# Altium schematic sheet HPS_UART.SchDoc
size A4; Organization: ICNS, MARCS Institute; Address1: Werrington South Campus, Great Western Highway; Address2: Werrington, NSW, 2747; SheetNumber: 15; SheetTotal: 16
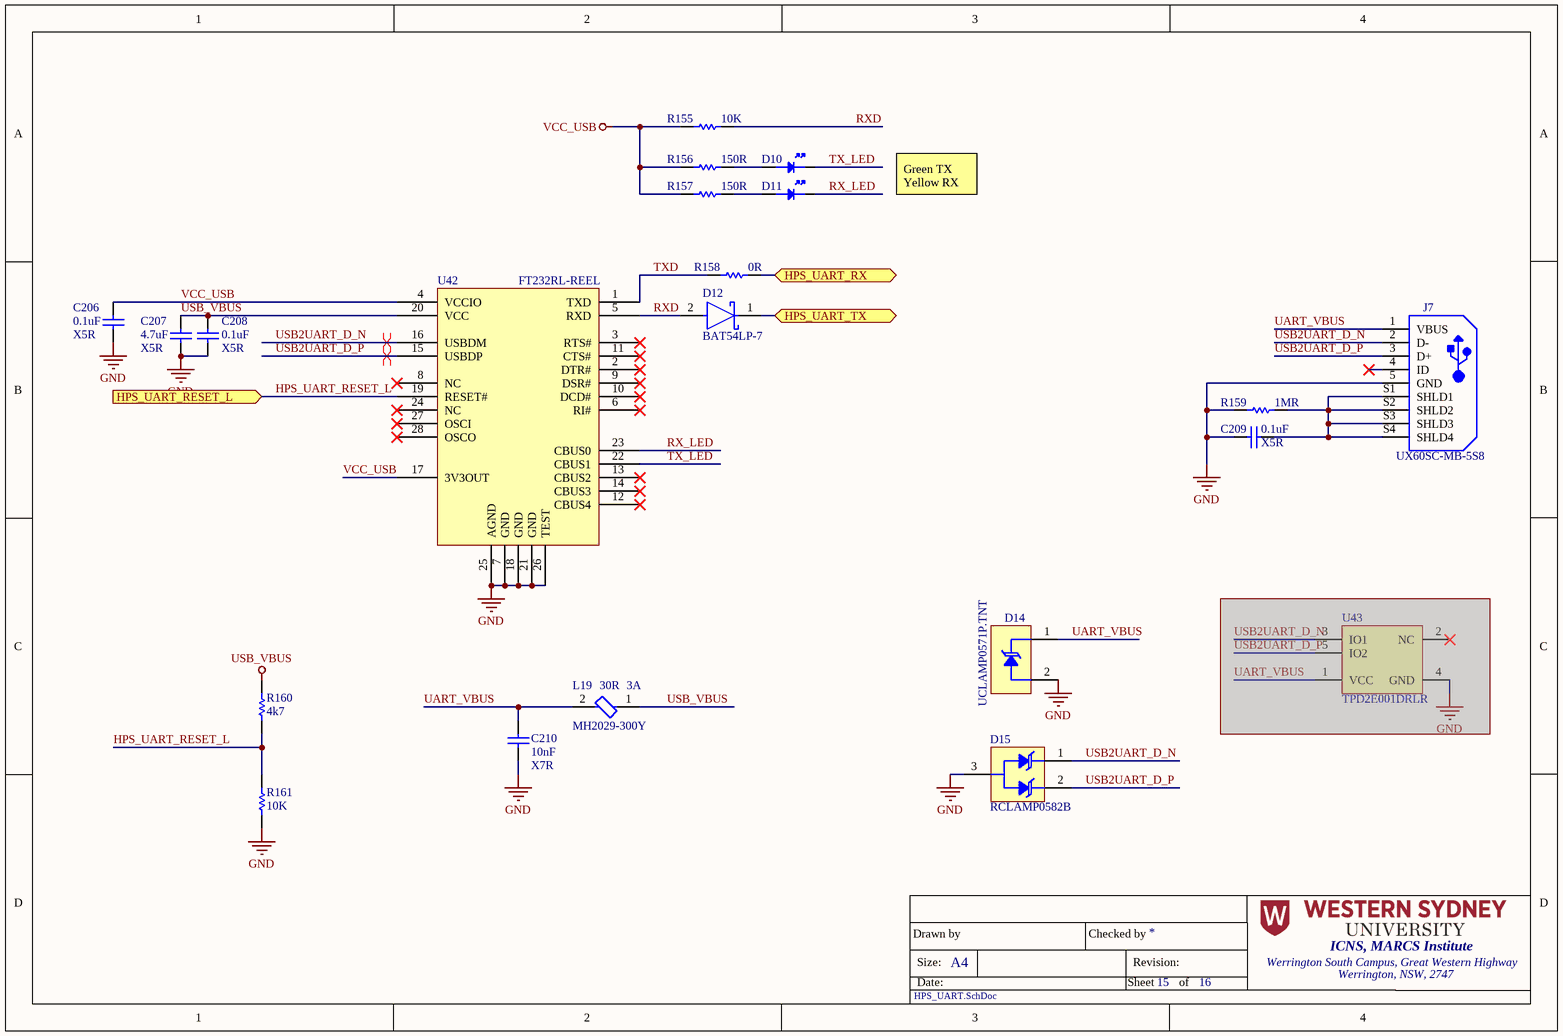
[diagram p0: HPS_UART.SchDoc]

## Parts
C206  value 0.1uF  Dielectric: X5R  [CAP 0201 (0603)]  (hidden comment: CL03A104KP3NNNC)
C207  value 4.7uF  Dielectric: X5R  [CAP 0402 (1005)]  (hidden comment: C1005X5R1A475K050BC)
C208  value 0.1uF  Dielectric: X5R  [CAP 0201 (0603)]  (hidden comment: CL03A104KP3NNNC)
C209  value 0.1uF  Dielectric: X5R  [CAP 0201 (0603)]  (hidden comment: CL03A104KP3NNNC)
C210  value 10nF  Dielectric: X7R  [CAP 0201 (0603)]  (hidden comment: GRM033R71A103KA01D)
D10  150060VS75000  [DIOC 0603 (1608)]  (value not drawn)
D11  150060YS75000  [DIOC 0603 (1608)]  (value not drawn)
D12  BAT54LP-7  [FP-X1-DFN1006-2-MFG]
D14  UCLAMP0571P.TNT  [uCLAMP0571P]
D15  RCLAMP0582B  [SOT50P160X90-3N]
J7  UX60SC-MB-5S8  [HIROSE_UX60SC-MB-5S8]
L19  MH2029-300Y  value 30R  Max DC Current: 3A  [INDC2016X13N]
R155  value 10K  [RES 0201 (0603)]  (hidden comment: AC0201FR-0710KL)
R156  value 150R  [RES 0603 (1608)]  (hidden comment: AC0603FR-10150RL)
R157  value 150R  [RES 0603 (1608)]  (hidden comment: AC0603FR-10150RL)
R158  value 0R  [RES 0201 (0603)]  (hidden comment: AF0201JR-070RL)
R159  value 1MR  [RES 0201 (0603)]  (hidden comment: ERJ-1GNF1004C)
R160  value 4k7  [RES 0201 (0603)]  (hidden comment: AC0201FR-074K7L)
R161  value 10K  [RES 0201 (0603)]  (hidden comment: AC0201FR-0710KL)
U42  FT232RL-REEL  [SOP65P780X200-28N]
U43  TPD2E001DRLR  [DRL0005A_L]  (masked out: inside a compile mask, not in the netlist)

## Ports
HPS_UART_RESET_L (in), HPS_UART_RX (bidir), HPS_UART_TX (bidir)

## Nets
GND: C206.2 C207.2 C208.2 C209.2 C210.2 D14.2(In_2) D15.3 J7.5(GND) R159.1 R161.1 U42.7(GND) U42.18(GND) U42.21(GND) U42.25(AGND) U42.26(TEST)
USB_VBUS: C207.1 C208.1 L19.1 R160.2 U42.20(VCC)
VCC_USB: C206.1 R155.2 R156.2 R157.2 U42.4(VCCIO) U42.17(3V3OUT)
HPS_UART_RESET_L: R160.1 R161.2 U42.19(RESET#) ; port HPS_UART_RESET_L
HPS_UART_RX: R158.1 ; port HPS_UART_RX
HPS_UART_TX: D12.1(C) ; port HPS_UART_TX
RX_LED: D11.1(K) U42.23(CBUS0)
RXD: D12.2(A) R155.1 U42.5(RXD)
TX_LED: D10.1(K) U42.22(CBUS1)
TXD: R158.2 U42.1(TXD)
UART_VBUS: C210.1 D14.1(In_1) J7.1(VBUS) L19.2
USB2UART_D_N: D15.1(In_1) J7.2(D-) U42.16(USBDM)
USB2UART_D_P: D15.2(In_2) J7.3(D+) U42.15(USBDP)
NetC209_1: C209.1 J7.S1(SHLD1) J7.S2(SHLD2) J7.S3(SHLD3) J7.S4(SHLD4) R159.2
NetD10_2: D10.2(A) R156.1
NetD11_2: D11.2(A) R157.1

Not connected (* = marked no-connect by the designer): J7 4(ID)*; U42 2(DTR#)* 3(RTS#)* 6(RI#)* 8(NC)* 9(DSR#)* 10(DCD#)* 11(CTS#)* 12(CBUS4)* 13(CBUS2)* 14(CBUS3)* 24(NC)* 27(OSCI)* 28(OSCO)*

## Layout directives
differential pair; net class DIGITAL; differential pair class USB2UART_D: USB2UART_D_N
differential pair; differential pair class USB2UART_D; net class DIGITAL: USB2UART_D_P

## Notes on the sheet
- Green TX
  Yellow RX
- Drawn by
- Size:
- Date:
- A4
- Checked by
- Sheet
- Revision:
- of

## Library data of the parts
C206 C208 C209 = CMP-003-000014-1: Cap Ceramic 0.1uF 10V X5R 10% Pad SMD 0201 85C T/R; Manufacturer: Samsung; Capacitance: 100nF; Stock 1: 12175; Pricing 1: 1=0.10000, 10=0.02900, 50=0.01600, 100=0.01300, 500=0.00932, 1000=0.00732, 2500=0.00666, 5000=0.00612 (USD); RoHS: Yes; Mount: Surface Mount; Case/Package: 0201; Case Code (Metric): 0603; Case Code (Imperial): 0201; Contact Plating: Tin; Min Operating Temperature: -55°C; Max Operating Temperature: 85°C; Tolerance: 10%; Packaging: Tape and Reel; Package Quantity: 1; Voltage Rating: 10V; Length: 0.6mm; Height: 0.3mm; Width: 0.012inch; Thickness: 0.013inch; Depth: 0.3mm; Radiation Hardening: No; ComponentLink1URL: https://datasheet.ciiva.com/25803/cl03a104kp3nnnc-25803204.pdf?src-supplier=Digi-Key; ComponentLink1Description: https://datasheet.ciiva.com/25803/cl03a104kp3nnnc-25803204.pdf?src-supplier=Digi-Key; ComponentLink2URL: https://datasheet.ciiva.com/26838/getdatasheetpartid-357484-26838083.pdf?src-supplier=Verical; ComponentLink2Description: https://datasheet.ciiva.com/26838/getdatasheetpartid-357484-26838083.pdf?src-supplier=Verical; Source: ICNS_PropheseeLib.SchLib; Manufacturer Part Number: CL03A104KP3NNNC; Lead Free: Lead Free; Series: CL; Design Item ID: CL03A104KP3NNNC; Voltage Rating (DC): 10V; Category: Ceramic Capacitors; Construction: Flat
C207 = CMP-003-000024-1: Cap Multilayer Ceramic 4.7uF 10 V X5R ±10 % SMT 0402  C Series; Manufacturer: TDK; Tolerance: 10%; Voltage Rating: 10V; Stock 1: 490145; Pricing 1: 1=0.48000, 10=0.33000, 50=0.23100, 100=0.19800, 500=0.14850, 1000=0.12540, 2500=0.11880, 5000=0.11220 (USD); RoHS: Yes; Mount: Surface Mount; Case/Package: 0402; Case Code (Metric): 1005; Case Code (Imperial): 0402; Min Operating Temperature: -55°C; Max Operating Temperature: 85°C; Packaging: Cut Tape; Package Quantity: 10000; Capacitance: 4.7uF; Length: 0.039inch; Width: 0.02inch; Thickness: 0.022inch; ComponentLink1URL: https://datasheet.ciiva.com/14895/tdkmlcccaprange-14895670.pdf?src-supplier=Digi-Key; ComponentLink1Description: https://datasheet.ciiva.com/14895/tdkmlcccaprange-14895670.pdf?src-supplier=Digi-Key; ComponentLink2URL: https://datasheet.ciiva.com/14895/tdkmlcccaprange-14895671.pdf?src-supplier=Digi-Key; ComponentLink2Description: https://datasheet.ciiva.com/14895/tdkmlcccaprange-14895671.pdf?src-supplier=Digi-Key; ComponentLink3Description: https://datasheet.ciiva.com/14895/tdkmlcccaprange-14895672.pdf?src-supplier=Digi-Key; REACH SVHC: No SVHC; Lead Free: Lead Free; Category: Ceramic Capacitors; Series: C; ComponentLink3URL: https://datasheet.ciiva.com/14895/tdkmlcccaprange-14895672.pdf?src-supplier=Digi-Key; Voltage Rating (DC): 10V; Source: ICNS_PropheseeLib.SchLib; Design Item ID: C1005X5R1A475K050BC; Dielectric Material: Ceramic; Manufacturer Part Number: C1005X5R1A475K050BC
C210 = CMP-003-000022-2: Cap Multilayer Ceramic 10nF 10V X7R 0201 ±10 % Tolerance SMT; Manufacturer: Murata; Tolerance: 10%; Stock 1: 6245; Pricing 1: 1=0.10000, 10=0.02000, 50=0.01060, 100=0.00870, 500=0.00624, 1000=0.00490, 2500=0.00446, 5000=0.00410 (USD); RoHS: Yes; Mount: Surface Mount; Case/Package: 0201; Case Code (Metric): 0603; Case Code (Imperial): 0201; Min Operating Temperature: -55°C; Max Operating Temperature: 125°C; Packaging: Tape and Reel; Package Quantity: 1; Capacitance: 10nF; Voltage Rating: 10V; Length: 0.6mm; Height: 0.3mm; Width: 0.012inch; Thickness: 0.013inch; Depth: 0.3mm; Radiation Hardening: No; ComponentLink1URL: https://datasheet.ciiva.com/129/grm033r71a103ka01-01-129814.pdf?src-supplier=Digi-Key; ComponentLink1Description: https://datasheet.ciiva.com/129/grm033r71a103ka01-01-129814.pdf?src-supplier=Digi-Key; ComponentLink2URL: https://datasheet.ciiva.com/129/grm033r71a103ka01-01-129815.pdf?src-supplier=Digi-Key; ComponentLink2Description: https://datasheet.ciiva.com/129/grm033r71a103ka01-01-129815.pdf?src-supplier=Digi-Key; Source: ICNS_PropheseeLib.SchLib; Manufacturer Part Number: GRM033R71A103KA01D; Lead Free: Lead Free; Design Item ID: GRM033R71A103KA01D; Voltage Rating (DC): 10V; Category: Ceramic Capacitors; Material: Ceramic; ComponentLink7URL: https://datasheet.ciiva.com/5422/product-5422667.pdf?src-supplier=Mouser; ComponentLink5URL: https://datasheet.ciiva.com/18184/getdatasheetpartid-158821-18184066.pdf?src-supplier=Verical; ComponentLink4URL: https://datasheet.ciiva.com/16467/product-16467346.pdf?src-supplier=Future+Electronics; ComponentLink3URL: https://datasheet.ciiva.com/11789/0900766b80ef921d-11789049.pdf?src-supplier=RSComponents; Voltage: 10V; RoHS Compliant: Yes; ComponentLink3Description: https://datasheet.ciiva.com/11789/0900766b80ef921d-11789049.pdf?src-supplier=RSComponents; ComponentLink5Description: https://datasheet.ciiva.com/18184/getdatasheetpartid-158821-18184066.pdf?src-supplier=Verical; ComponentLink6URL: https://datasheet.ciiva.com/29199/455719-da-01-en-vs-kondensator-0201-29199284.pdf?src-supplier=Conrad; ComponentLink6Description: https://datasheet.ciiva.com/29199/455719-da-01-en-vs-kondensator-0201-29199284.pdf?src-supplier=Conrad; ComponentLink7Description: https://datasheet.ciiva.com/5422/product-5422667.pdf?src-supplier=Mouser; ComponentLink4Description: https://datasheet.ciiva.com/16467/product-16467346.pdf?src-supplier=Future+Electronics; Termination: SMD/SMT; REACH SVHC: No SVHC
D10 = CMP-004-000007-2: Led, Green, 570 Nm, 2 V, 30 Ma, 40 Mcd Rohs Compliant: Yes; Manufacturer: Wurth Electronics; Wavelength: 570nm; Forward Voltage: 2V; Forward Current: 30mA; Lens Style: Clear,Rectangular; Luminous Intensity: 40mcd; Test Current: 20mA; Viewing Angle: 140°; Case/Package: 0603; Case Code (Metric): 1608; Width: 0.8mm; Height: 0.7mm; Case Code (Imperial): 0603; Min Operating Temperature: -40°C; Mount: Surface Mount; REACH SVHC: Unknown; Packaging: Tape and Reel; Color: Green; Max Operating Temperature: 85°C; Package Quantity: 1; Dominant Wavelength: 570nm; Length: 1.6mm; RoHS Compliant: Yes; Source: ICNS_PropheseeLib.SchLib; Design Item ID: 150060VS75000; ComponentLink1Description: https://datasheet.ciiva.com/29562/150060vs75000-29562919.pdf?src-supplier=Digi-Key; Manufacturer Part Number: 150060VS75000; Pricing 1: 100=0.13300, 500=0.10300, 1000=0.09800, 2000=0.09200, 4000=0.08800 (USD); Category: LEDs; RoHS: Yes; Number of Pins: 2; Stock 1: 1; ComponentLink1URL: https://datasheet.ciiva.com/29562/150060vs75000-29562919.pdf?src-supplier=Digi-Key
D11 = CMP-004-000008-2: Led, Yellow, 590 Nm, 2 V, 30 Ma, 120 Mcd Rohs Compliant: Yes; Manufacturer: Wurth Electronics; Wavelength: 590nm; Forward Voltage: 2V; Forward Current: 30mA; Lens Style: Clear,Rectangular; Luminous Intensity: 120mcd; Test Current: 20mA; Viewing Angle: 140°; Case/Package: 0603; Case Code (Metric): 1608; Width: 0.8mm; Height: 0.7mm; Case Code (Imperial): 0603; Min Operating Temperature: -40°C; Mount: Surface Mount; REACH SVHC: Unknown; Packaging: Tape and Reel; Color: Yellow; Max Operating Temperature: 85°C; Package Quantity: 4000; Dominant Wavelength: 590nm; Length: 1.6mm; RoHS Compliant: Yes; ComponentLink5Description: https://datasheet.ciiva.com/29563/150060ys75000-29563045.pdf?src-supplier=Digi-Key; ComponentLink2URL: https://datasheet.ciiva.com/29279/759432-da-01-en-chipled-0603-w-kl-gelb-150060ys75000-29279206.pdf?src-supplier=Conrad; ComponentLink1Description: https://datasheet.ciiva.com/23843/150060ys75000-23843250.pdf?src-supplier=Newark; Design Item ID: 150060YS75000; ComponentLink4Description: https://datasheet.ciiva.com/29563/150060ys75000-29563033.pdf?src-supplier=Digi-Key; ComponentLink6URL: https://datasheet.ciiva.com/22656/1911348-22656951.pdf?src-supplier=Element14; ComponentLink6Description: https://datasheet.ciiva.com/22656/1911348-22656951.pdf?src-supplier=Element14; ComponentLink4URL: https://datasheet.ciiva.com/29563/150060ys75000-29563033.pdf?src-supplier=Digi-Key; ComponentLink3Description: https://datasheet.ciiva.com/48430/150060ys75000-eng-tds-48430044.pdf?src-supplier=Distrelec; ComponentLink5URL: https://datasheet.ciiva.com/29563/150060ys75000-29563045.pdf?src-supplier=Digi-Key; RoHS: Yes; Manufacturer Part Number: 150060YS75000; Source: ICNS_PropheseeLib.SchLib; Category: LEDs; ComponentLink3URL: https://datasheet.ciiva.com/48430/150060ys75000-eng-tds-48430044.pdf?src-supplier=Distrelec; Stock 1: 1; ComponentLink1URL: https://datasheet.ciiva.com/23843/150060ys75000-23843250.pdf?src-supplier=Newark; Pricing 1: 100=0.13300, 500=0.10300, 1000=0.09800, 2000=0.09200, 4000=0.08800 (USD); ComponentLink2Description: https://datasheet.ciiva.com/29279/759432-da-01-en-chipled-0603-w-kl-gelb-150060ys75000-29279206.pdf?src-supplier=Conrad
D12 = CMP-004-000001-1: Diode Schottky 30 V 200mA (DC); Manufacturer: Diodes; Capacitance: 10pF; Forward Voltage: 1V; Max Reverse Voltage (DC): 30V; Max Forward Surge Current (Ifsm): 600mA; Reverse Recovery Time: 5ns; Power Dissipation: 250mW; Element Configuration: Single; Polarity: Standard; Max Reverse Current: 2uA; Manufacturer Part Number: BAT54LP-7; ComponentLink2URL: https://datasheet.ciiva.com/16210/ds30504-16210561.pdf?src-supplier=Future+Electronics; Forward Current: 200mA; ComponentLink2Description: https://datasheet.ciiva.com/16210/ds30504-16210561.pdf?src-supplier=Future+Electronics; Category: Schottky Diodes; Lead Free: Lead Free; RoHS: Yes; Height: 0.47mm; REACH SVHC: No SVHC; ComponentLink1Description: https://datasheet.ciiva.com/4715/ds30504-85267-4715512.pdf?src-supplier=Mouser; Max Operating Temperature: 125°C; Source: ICNS_PropheseeLib.SchLib; ComponentLink11URL: https://datasheet.ciiva.com/913/ds30504-913080.pdf?src-supplier=Digi-Key; Package Quantity: 3000; Min Operating Temperature: -65°C; ComponentLink8Description: https://datasheet.ciiva.com/8300/ds30504-8300695.pdf?src-supplier=Avnet; Voltage Rating (DC): 30V; Number of Pins: 2; Series: -; Output Current: 200mA; Pricing 1: 50=0.37100, 500=0.34200, 1250=0.32200, 2500=0.29500, 5000=0.27200 (USD); Design Item ID: BAT54LP-7; Peak Non-Repetitive Surge Current: 600mA; ComponentLink9URL: https://datasheet.ciiva.com/913/ds30504-913081.pdf?src-supplier=Digi-Key; Width: 0.6mm; ComponentLink7Description: https://datasheet.ciiva.com/25947/ds30504-25947226.pdf?src-supplier=Avnet+Europe; ComponentLink3Description: https://datasheet.ciiva.com/1180/ds30504-1180298.pdf?src-supplier=Element14; Packaging: Tape and Reel; ComponentLink10URL: https://datasheet.ciiva.com/913/ds30504-913082.pdf?src-supplier=Digi-Key; ComponentLink6Description: https://datasheet.ciiva.com/15144/getdatasheetpartid-39647-15144085.pdf?src-supplier=Verical; ComponentLink4URL: https://datasheet.ciiva.com/22695/1915672-22695255.pdf?src-supplier=Element14; ComponentLink6URL: https://datasheet.ciiva.com/15144/getdatasheetpartid-39647-15144085.pdf?src-supplier=Verical; ComponentLink1URL: https://datasheet.ciiva.com/4715/ds30504-85267-4715512.pdf?src-supplier=Mouser; Max Repetitive Reverse Voltage (Vrrm): 30V; ComponentLink5URL: https://datasheet.ciiva.com/8303/ds30504-8303286.pdf?src-supplier=Avnet; Stock 1: 3850; Contact Plating: Gold; Radiation Hardening: No; Mount: Surface Mount; RoHS Compliant: Yes; ComponentLink5Description: https://datasheet.ciiva.com/8303/ds30504-8303286.pdf?src-supplier=Avnet; Length: 1mm; Average Rectified Current: 200mA; ComponentLink8URL: https://datasheet.ciiva.com/8300/ds30504-8300695.pdf?src-supplier=Avnet; ComponentLink7URL: https://datasheet.ciiva.com/25947/ds30504-25947226.pdf?src-supplier=Avnet+Europe; Power Rating: 250mW; ComponentLink4Description: https://datasheet.ciiva.com/22695/1915672-22695255.pdf?src-supplier=Element14; ComponentLink9Description: https://datasheet.ciiva.com/913/ds30504-913081.pdf?src-supplier=Digi-Key; ComponentLink3URL: https://datasheet.ciiva.com/1180/ds30504-1180298.pdf?src-supplier=Element14; Current Rating: 200mA; ComponentLink10Description: https://datasheet.ciiva.com/913/ds30504-913082.pdf?src-supplier=Digi-Key; Case/Package: DFN; ComponentLink11Description: https://datasheet.ciiva.com/913/ds30504-913080.pdf?src-supplier=Digi-Key
D14 = CMP-024-000002-2: ESD Suppressor Diode TVS Uni-Dir 5V Automotive 2-Pin SGP T/R; Manufacturer: Semtech; Clamping Voltage: 15V; Peak Pulse Current: 80A; Number of Unidirectional Channels: 1; Power Line Protection: No; Min Breakdown Voltage: 6V; Number of Pins: 2; Design Item ID: UCLAMP0571P.TNT; Packaging: Tape and Reel; ComponentLink2URL: https://media.digikey.com/pdf/Data%20Sheets/~No%20Display/Semtech%20PDFs/uClamp0571P-3671P.pdf?src-supplier=Digi-Key; Max Operating Temperature: 125°C; Stock 1: 16165; RoHS: Yes; Source: Falcon_Neuro.SchLib; Reverse Standoff Voltage: 5V; ComponentLink1Description: http://www.mouser.com/ds/2/761/uclampxx71p_2-779780.pdf?src-supplier=Mouser; Min Operating Temperature: -40°C; ComponentLink1URL: http://www.mouser.com/ds/2/761/uclampxx71p_2-779780.pdf?src-supplier=Mouser; ComponentLink2Description: https://media.digikey.com/pdf/Data%20Sheets/~No%20Display/Semtech%20PDFs/uClamp0571P-3671P.pdf?src-supplier=Digi-Key; Resistor Type: Zener; Mount: Surface Mount; Pricing 1: 1=0.91000, 10=0.79900, 50=0.79900, 100=0.61300, 500=0.48400, 1000=0.38800, 2500=0.35100, 5000=0.31900, 10000=0.30700 (USD); Category: TVS Diodes; Manufacturer Part Number: UCLAMP0571P.TNT
D15 = CMP-004-000012-1: ESD Suppressor TVS Uni-Dir/Bi-Dir 5V 3-Pin SOT-523 T/R; Manufacturer Part Number: RCLAMP0582B.TCT; Manufacturer: Semtech; Peak Pulse Current: 15A; Min Breakdown Voltage: 6V; Leakage Current: 100nA; Peak Pulse Power: 300W; Direction: Unidirectional,Bidirectional; Clamping Voltage: 20V; Number of Unidirectional Channels: 2; Diode Type: ZENER; Power Line Protection: No; ComponentLink1URL: http://www.mouser.com/ds/2/761/down-768397.pdf?src-supplier=Mouser; Source: ICNS_PropheseeLib.SchLib; ComponentLink2Description: http://components.arrow.com/part/dataview/51525300S194820N8297?src-supplier=Arrow+Electronics; Case/Package: SC; ComponentLink3URL: http://www.semtech.com/images/datasheet/rclamp0582b.pdf?src-supplier=Digi-Key; Depth: 0.8mm; Pricing 1: 3000=0.34050, 9000=0.32450, 24000=0.31460 (USD); Resistor Type: Zener; Packaging: Tape and Reel; Category: TVS Diodes; Mount: Surface Mount; Design Item ID: RCLAMP0582B; Radiation Hardening: No; Working Voltage: 5V; RoHS: Yes; Reverse Standoff Voltage: 5V; ComponentLink3Description: http://www.semtech.com/images/datasheet/rclamp0582b.pdf?src-supplier=Digi-Key; Min Operating Temperature: -55°C; Number of Pins: 3; Max Operating Temperature: 125°C; ComponentLink2URL: http://components.arrow.com/part/dataview/51525300S194820N8297?src-supplier=Arrow+Electronics; ComponentLink1Description: http://www.mouser.com/ds/2/761/down-768397.pdf?src-supplier=Mouser; Series: RailClamp®; Stock 1: 48000; Length: 1.6mm
J7 = CMP-010-000018-4: Conn Mini USB 2.0 Type B RCP 5 POS 0.8mm Solder RA SMD/Thru-Hole 5 Terminal 1 Port T/R; Manufacturer: Hirose; Number of Contacts: 5; Number of Ports: 1; Gender: Receptacle; Connector Type: USB,Receptacle; Current Rating: 1A; Insulation Resistance: 100MR; Max Voltage Rating (AC): 5V; USB Standard: USB 2.0; Packaging: Tape and Reel; Pitch: 0.8mm; Contact Plating: Gold; Contact Material: Copper Alloy,Copper; RoHS: Yes; Length: 7.7mm; ComponentLink2Description: https://datasheet.ciiva.com/4598/ed-ux-20140717-4598805.pdf?src-supplier=Mouser; ComponentLink2URL: https://datasheet.ciiva.com/4598/ed-ux-20140717-4598805.pdf?src-supplier=Mouser; Design Item ID: UX60SC-MB-5S8; ComponentLink3URL: https://datasheet.ciiva.com/15181/getdatasheetpartid-457316-15181367.pdf?src-supplier=Verical; Number of Positions: 5; Number of Terminals/Pins: 5; Package Quantity: 1000; Min Operating Temperature: -30°C; Series: UX60S; Mount: Surface Mount,Horizontal,Through Hole; Max Operating Temperature: 75°C; Manufacturer Part Number: UX60SC-MB-5S8; Termination: Solder; ComponentLink1Description: https://datasheet.ciiva.com/22666/1693469-22666928.pdf?src-supplier=Element14; Orientation: Right Angle; Lead Free: Lead Free; Depth: 7mm; Max Current Rating: 1A; Number of Rows: 1; REACH SVHC: No SVHC; RoHS Compliant: Yes; Pricing 1: 1000=0.49400, 2000=0.44800, 5000=0.43300 (USD); Category: USB Connectors; Source: ICNS_PropheseeLib.SchLib; ComponentLink3Description: https://datasheet.ciiva.com/15181/getdatasheetpartid-457316-15181367.pdf?src-supplier=Verical; ComponentLink1URL: https://datasheet.ciiva.com/22666/1693469-22666928.pdf?src-supplier=Element14; Stock 1: 1340
L19 = CMP-005-000010-1: FERRITE BEAD 30 OHM 0805 1LN; Manufacturer: Bourns; Current Rating: 4A; DC Resistance (DCR): 30mR; Shielding: Unshielded; Tolerance: 25%; Number of Lines: 1; Test Frequency: 100MHz; Case/Package: 0805; Core Material: Ferrite; Pricing 1: 1=0.08450, 10=0.07180, 25=0.06060, 100=0.03370 (USD); RoHS: Yes; Stock 1: 88; Manufacturer Part Number: MH2029-300Y; Category: Ferrite Beads and Chips; Case Code (Metric): 3216; Case Code (Imperial): 1206; RoHS Compliant: Yes; Design Item ID: MH2029-300Y; Source: ICNS_PropheseeLib.SchLib; Length: 0.079inch; Impedance: 30R; Mount: Surface Mount; REACH SVHC: No SVHC; Packaging: Tape and Reel; Height: 0.043inch; ComponentLink2Description: https://datasheet.ciiva.com/6212/mh-6212006.pdf?src-supplier=Digi-Key; Depth: 1.4mm; Max Current Rating: 3A; Width: 0.047inch; Max Operating Temperature: 125°C; ComponentLink3URL: https://datasheet.ciiva.com/6212/mh-6212008.pdf?src-supplier=Digi-Key; ComponentLink3Description: https://datasheet.ciiva.com/6212/mh-6212008.pdf?src-supplier=Digi-Key; ComponentLink1URL: https://datasheet.ciiva.com/12395/mh-69602-12395430.pdf?src-supplier=Mouser; ComponentLink1Description: https://datasheet.ciiva.com/12395/mh-69602-12395430.pdf?src-supplier=Mouser; Min Operating Temperature: -55°C; Package Quantity: 1; ComponentLink2URL: https://datasheet.ciiva.com/6212/mh-6212006.pdf?src-supplier=Digi-Key; Termination: SMD/SMT; Series: MH
R155 R161 = CMP-006-000021-1: Res Thick Film 0201 10K Ohm 1% 0.05W(1/20W) ±200ppm/C Pad SMD Automotive T/R; Manufacturer: Yageo; Max Power Dissipation: 50mW; Temperature Coefficient: 200ppm/°C; Resistance: 10kR; RoHS: Yes; Case/Package: 0201; Case Code (Metric): 0603; Case Code (Imperial): 0201; Min Operating Temperature: -55°C; Max Operating Temperature: 155°C; Tolerance: 1%; Number of Terminations: 2; Width: 0.012inch; ComponentLink1URL: http://www.yageo.com/NewPortal/yageodocoutput?fileName=/pdf/R-Chip/PYu-AC_51_RoHS_L_6.pdf&src-supplier=Digi-Key; ComponentLink1Description: http://www.yageo.com/NewPortal/yageodocoutput?fileName=/pdf/R-Chip/PYu-AC_51_RoHS_L_6.pdf&src-supplier=Digi-Key; Stock 1: 698280; Pricing 1: 1=0.10000, 10=0.06600, 100=0.02670, 1000=0.01201, 2500=0.01042, 5000=0.00861 (USD); Features: Moisture Resistant,Automotive AEC-Q200; Packaging: Tape and Reel; Length: 0.024inch; Height: 0.01inch; Source: ICNS_PropheseeLib.SchLib; Manufacturer Part Number: AC0201FR-0710KL; Category: Chip SMD Resistors; Resistor Type: Thick Film; Design Item ID: AC0201FR-0710KL
R156 R157 = CMP-006-000018-1: Chip Resistor Automotive Grade Thick Film 0603 150Ohm 1% Paper T/R; Manufacturer: Yageo; Power Rating: 100mW; RoHS: Yes; Case Code (Metric): 1608; Case Code (Imperial): 0603; Tolerance: 1%; Resistance: 150R; Source: ICNS_PropheseeLib.SchLib; Pricing: 1=0.10000, 10=0.02900, 100=0.01170, 1000=0.00527, 2500=0.00458, 5000=0.00378 (USD); Design Item ID: AC0603FR-10150RL; Stock: 17930; Category: Chip SMD Resistors; RoHS Compliant: Yes; Manufacturer Part Number: AC0603FR-10150RL
R158 = CMP-006-000020-1: Res Thick Film 0201 0 Ohm Sulfur Resistant Pad SMD Automotive T/R; Manufacturer: Yageo; Max Power Dissipation: 50mW; Resistance: 0mR; RoHS: Yes; Case/Package: 0201; Case Code (Metric): 0603; Case Code (Imperial): 0201; Min Operating Temperature: -55°C; Max Operating Temperature: 125°C; Number of Terminations: 2; Width: 0.012inch; ComponentLink1URL: http://www.mouser.com/ds/2/447/PYu-AF_51_RoHS_L_5-1085711.pdf?src-supplier=Mouser; ComponentLink1Description: http://www.mouser.com/ds/2/447/PYu-AF_51_RoHS_L_5-1085711.pdf?src-supplier=Mouser; ComponentLink2URL: http://www.yageo.com/documents/recent/PYu-AF_51_RoHS_L_5.pdf?src-supplier=Digi-Key; ComponentLink2Description: http://www.yageo.com/documents/recent/PYu-AF_51_RoHS_L_5.pdf?src-supplier=Digi-Key; Stock 1: 50009; Pricing 1: 1=0.11000, 10=0.09500, 25=0.06560, 50=0.05100, 100=0.03640, 250=0.02840, 500=0.02256, 1000=0.01602, 5000=0.01238 (USD); Features: Moisture Resistant,Anti-Sulfur; Termination: SMD/SMT; Package Quantity: 10000; Packaging: Tape and Reel; Length: 0.024inch; Height: 0.01inch; Design Item ID: AF0201JR-070RL; Weight: 6E-06oz; RoHS Compliant: Yes; Resistor Type: Thick Film; Source: ICNS_PropheseeLib.SchLib; Manufacturer Part Number: AF0201JR-070RL; Category: Chip SMD Resistors
R159 = CMP-006-000042-1: Res Thick Film 0201 1M Ohm 1% 0.05W(1/20W) ±200ppm/C Pad SMD Automotive T/R; Manufacturer: Panasonic; Max Power Dissipation: 50mW; Temperature Coefficient: 200ppm/°C; Working Voltage: 25V; RoHS: Yes; Mount: Surface Mount; Case/Package: 0201; Case Code (Metric): 0603; Case Code (Imperial): 0201; Min Operating Temperature: -55°C; Max Operating Temperature: 125°C; Tolerance: 1%; Number of Terminations: 2; Width: 0.3mm; ComponentLink1URL: https://datasheet.ciiva.com/43467/1678782-43467126.pdf?src-supplier=Farnell; ComponentLink1Description: https://datasheet.ciiva.com/43467/1678782-43467126.pdf?src-supplier=Farnell; ComponentLink2URL: https://datasheet.ciiva.com/46375/1678782-46375423.pdf?src-supplier=Element14; ComponentLink2Description: https://datasheet.ciiva.com/46375/1678782-46375423.pdf?src-supplier=Element14; ComponentLink3URL: https://datasheet.ciiva.com/22742/1678782-22742862.pdf?src-supplier=Element14; ComponentLink3Description: https://datasheet.ciiva.com/22742/1678782-22742862.pdf?src-supplier=Element14; Stock 1: 1665; Pricing 1: 1=0.10000, 10=0.06500, 100=0.02660, 1000=0.01192, 2500=0.01035, 5000=0.00855 (USD); Contact Plating: Tin,Matte; Package Quantity: 15000; Resistance: 1MR; Power Rating: 50mW; Packaging: Tape and Reel; Length: 0.6mm; Height: 0.01inch; Lead Free: Lead Free; ComponentLink4URL: https://datasheet.ciiva.com/22742/1678782-22742861.pdf?src-supplier=Element14; ComponentLink4Description: https://datasheet.ciiva.com/22742/1678782-22742861.pdf?src-supplier=Element14; Technology: THICK FILM; ComponentLink5URL: https://datasheet.ciiva.com/16201/aoa0000ce2-16201493.pdf?src-supplier=Future+Electronics; ComponentLink5Description: https://datasheet.ciiva.com/16201/aoa0000ce2-16201493.pdf?src-supplier=Future+Electronics; Resistor Type: Thick Film; Resistance Tolerance: 1%; Manufacturer Part Number: ERJ-1GNF1004C; Voltage Rating: 25V; Category: Chip SMD Resistors; Radiation Hardening: No; Voltage Rating (DC): 25V; Design Item ID: ERJ-1GNF1004C; REACH SVHC: No SVHC; Number of Pins: 2; Source: ICNS_PropheseeLib.SchLib; Series: ERJ
R160 = CMP-006-000022-1: Res Thick Film 0201 4.7K Ohm 1% 1/20W ±200ppm/°C Molded SMD Paper T/R; Manufacturer: Yageo; Max Power Dissipation: 50mW; Resistance: 4.7kR; RoHS: Yes; Case/Package: 0201; Case Code (Metric): 0603; Case Code (Imperial): 0201; Min Operating Temperature: -55°C; Max Operating Temperature: 155°C; Tolerance: 1%; Number of Terminations: 2; Temperature Coefficient: 200ppm/°C; Width: 0.012inch; ComponentLink1URL: http://www.yageo.com/NewPortal/yageodocoutput?fileName=/pdf/R-Chip/PYu-AC_51_RoHS_L_6.pdf&src-supplier=Digi-Key; ComponentLink1Description: http://www.yageo.com/NewPortal/yageodocoutput?fileName=/pdf/R-Chip/PYu-AC_51_RoHS_L_6.pdf&src-supplier=Digi-Key; Stock 1: 267560; Pricing 1: 1=0.10000, 10=0.06600, 100=0.02670, 1000=0.01201, 2500=0.01042, 5000=0.00861 (USD); Features: Moisture Resistant,Automotive AEC-Q200; Packaging: Tape and Reel; Length: 0.024inch; Height: 0.01inch; Lead Free: Lead Free; Source: ICNS_PropheseeLib.SchLib; Manufacturer Part Number: AC0201FR-074K7L; Design Item ID: AC0201FR-074K7L; Category: Chip SMD Resistors; Resistor Type: Thick Film
U42 = CMP-008-000005-1: USB Controller, 3MBd, USB2.0, 1.8 - 5.25 V, 28-Pin SSOP, USBmadeEZ-UART Series; Manufacturer: FTDI; Max Supply Voltage: 5.25V; Interface: UART,RS-232,RS-422,RS-485; Min Supply Voltage: 3.3V; Data Rate: 12Mbps; Operating Supply Current: 15mA; Number of Channels: 1; Voltage: 5V; Package Quantity: 2000; Min Operating Temperature: -40°C; Max Operating Temperature: 85°C; Mount: Surface Mount; Lead Free: Lead Free; Weight: 0.080001oz; Width: 5.3mm; Radiation Hardening: No; Length: 10.2mm; Packaging: Tape and Reel; Number of Pins: 28; Case/Package: SSOP; ComponentLink4URL: https://datasheet.ciiva.com/1787/ds-ft232r-1787048.pdf?src-supplier=Digi-Key; ComponentLink2URL: https://datasheet.ciiva.com/4787/ds-ft232r-11534-4787658.pdf?src-supplier=Mouser; ComponentLink7URL: https://datasheet.ciiva.com/16200/ds-ft232r-16200652.pdf?src-supplier=Future+Electronics; ComponentLink6URL: https://datasheet.ciiva.com/1787/ds-ft232r-1787049.pdf?src-supplier=Digi-Key; Height: 1.75mm; Pricing 1: 1=4.70000, 10=4.25000, 50=4.05000, 100=3.85000, 250=3.45000, 500=3.05000, 1000=2.85002 (USD); ComponentLink8URL: https://datasheet.ciiva.com/15150/getdatasheetpartid-643207-15150506.pdf?src-supplier=Verical; ComponentLink1Description: https://datasheet.ciiva.com/34304/2161019-34304054.pdf?src-supplier=Jameco; RoHS Compliant: Yes; ComponentLink5Description: https://datasheet.ciiva.com/1787/ds-ft232r-1787047.pdf?src-supplier=Digi-Key; Number of Transceivers: 1; Series: USBmadeEZ-UART; ComponentLink3Description: https://datasheet.ciiva.com/26841/ft232rl-reel-26841080.pdf?src-supplier=IIIC; Manufacturer Part Number: FT232RL-REEL; ComponentLink4Description: https://datasheet.ciiva.com/1787/ds-ft232r-1787048.pdf?src-supplier=Digi-Key; ComponentLink5URL: https://datasheet.ciiva.com/1787/ds-ft232r-1787047.pdf?src-supplier=Digi-Key; Design Item ID: FT232RL-REEL; REACH SVHC: No SVHC; ComponentLink6Description: https://datasheet.ciiva.com/1787/ds-ft232r-1787049.pdf?src-supplier=Digi-Key; ComponentLink7Description: https://datasheet.ciiva.com/16200/ds-ft232r-16200652.pdf?src-supplier=Future+Electronics; ComponentLink1URL: https://datasheet.ciiva.com/34304/2161019-34304054.pdf?src-supplier=Jameco; Source: ICNS_PropheseeLib.SchLib; ComponentLink8Description: https://datasheet.ciiva.com/15150/getdatasheetpartid-643207-15150506.pdf?src-supplier=Verical; ComponentLink2Description: https://datasheet.ciiva.com/4787/ds-ft232r-11534-4787658.pdf?src-supplier=Mouser; ComponentLink3URL: https://datasheet.ciiva.com/26841/ft232rl-reel-26841080.pdf?src-supplier=IIIC; RoHS: Yes; Category: Interface ICs
U43 = CMP-004-000003-1: Dual Protection Diode 1.5-pF, 5.5-V, ±8-kV ESD protection diode with 1-nA max leakage & VCC pin for USB 2.0 5-SOT-5X3 -40 to 85; Manufacturer: Texas Instruments; Number of Channels: 2; Leakage Current: 1nA; Peak Pulse Current: 10A; Power Line Protection: Yes; Max Supply Voltage: 5.5V; Direction: Unidirectional; Interface: LVDS,USB,Ethernet; Min Breakdown Voltage: 11V; Capacitance: 1.5pF; Clamping Voltage: 105.5V; Min Supply Voltage: 900mV; ComponentLink3Description: https://datasheet.ciiva.com/7650/1851973-7650906.pdf?src-supplier=Element14; ComponentLink1Description: https://datasheet.ciiva.com/4479/slls684f-121568-4479427.pdf?src-supplier=Mouser; ComponentLink2Description: https://datasheet.ciiva.com/15134/getdatasheetpartid-186217-15134447.pdf?src-supplier=Verical; ComponentLink1URL: https://datasheet.ciiva.com/4479/slls684f-121568-4479427.pdf?src-supplier=Mouser; ComponentLink2URL: https://datasheet.ciiva.com/15134/getdatasheetpartid-186217-15134447.pdf?src-supplier=Verical; ComponentLink3URL: https://datasheet.ciiva.com/7650/1851973-7650906.pdf?src-supplier=Element14; Package Quantity: 1; Manufacturer Part Number: TPD2E001DRLR; ComponentLink5Description: https://datasheet.ciiva.com/338/tpd2e001-338328.pdf?src-supplier=Digi-Key; ComponentLink4URL: https://datasheet.ciiva.com/338/tpd2e001-338329.pdf?src-supplier=Digi-Key; RoHS: Yes; Width: 1.2mm; Element Configuration: Dual; Category: Interface ICs; Reverse Standoff Voltage: 5.5V; Working Voltage: 5.5V; Contact Plating: Gold; Termination: SMD/SMT; ComponentLink9Description: https://datasheet.ciiva.com/16476/tpd2e001-16476822.pdf?src-supplier=Avnet+Asia; Case/Package: SOT; Radiation Hardening: No; ComponentLink6Description: https://datasheet.ciiva.com/338/tpd2e001-338330.pdf?src-supplier=Digi-Key; Source: ICNS_PropheseeLib.SchLib; ComponentLink4Description: https://datasheet.ciiva.com/338/tpd2e001-338329.pdf?src-supplier=Digi-Key; Height: 0.55mm; Breakdown Voltage: 11V; ComponentLink6URL: https://datasheet.ciiva.com/338/tpd2e001-338330.pdf?src-supplier=Digi-Key; ComponentLink5URL: https://datasheet.ciiva.com/338/tpd2e001-338328.pdf?src-supplier=Digi-Key; Max Operating Temperature: 85°C; ComponentLink8Description: https://datasheet.ciiva.com/25955/tpd2e001-25955782.pdf?src-supplier=Avnet+Europe; Polarity: Unidirectional; ComponentLink7Description: https://datasheet.ciiva.com/14423/tpd2e001-14423679.pdf?src-supplier=Avnet; Lead Free: Lead Free; Number of Pins: 5; Length: 1.6mm; Weight: 9.9E-05oz; Pricing 1: 1=0.65000, 10=0.56000, 100=0.41850, 500=0.32882, 1000=0.25408, 2000=0.24675 (USD); Packaging: Tape and Reel; Depth: 1.2mm; ComponentLink8URL: https://datasheet.ciiva.com/25955/tpd2e001-25955782.pdf?src-supplier=Avnet+Europe; ComponentLink7URL: https://datasheet.ciiva.com/14423/tpd2e001-14423679.pdf?src-supplier=Avnet; Number of Bidirectional Channels: 2; Design Item ID: TPD2E001DRLR; ComponentLink9URL: https://datasheet.ciiva.com/16476/tpd2e001-16476822.pdf?src-supplier=Avnet+Asia; Min Operating Temperature: -40°C; REACH SVHC: No SVHC